# Altium project project_simulatie.PrjPcb
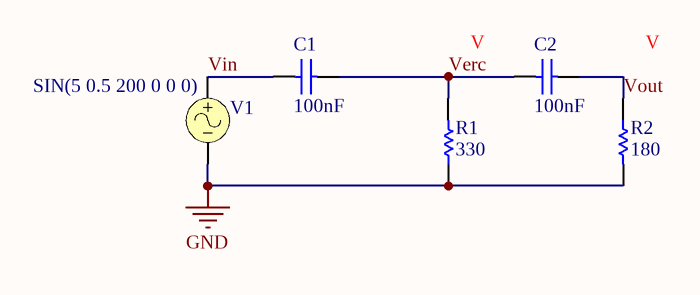
[diagram p0: rc-filter.SchDoc]
1 sheet, 5 parts. Net scope: global (net labels, ports and power ports of the same name join across sheets).

## Sheet rc-filter.SchDoc
size A4; SheetNumber: 1; SheetTotal: 2

### Parts
C1  value 100nF  (hidden comment: Capacitor)
C2  value 100nF  (hidden comment: Capacitor)
R1  value 330  (hidden comment: Resistor)
R2  value 180  (hidden comment: Resistor)
V1  SIN(5 0.5 200 0 0 0)

### Nets
GND: R1.1 R2.2 V1.2
Verc: C1.2 C2.1 R1.2
Vin: C1.1 V1.1
Vout: C2.2 R2.1

### Library data of the parts
C1 C2 = Capacitor: SimulationGenericComponent: True
R1 R2 = Resistor: TC1: 0; SimulationGenericComponent: True; TC2: 0
V1 = VSIN: Sinusoidal Voltage Source; Note: PCB Footprint - Not required; Offset: 5; Amplitude: 0.5; Frequency: 200; Delay: 0; AC Magnitude: 1; Published: 8-Jun-2000; LatestRevisionDate: 15-Nov-2004; LatestRevisionNote: Corrected Netlist.; PackageReference: Not Applicable; Publisher: Altium Limited; Damping Factor: 0; Phase: 0; DC Magnitude: 0; AC Phase: 0